# Altium schematic sheet Master.SchDoc
size A4; SheetNumber: 1; SheetTotal: 6
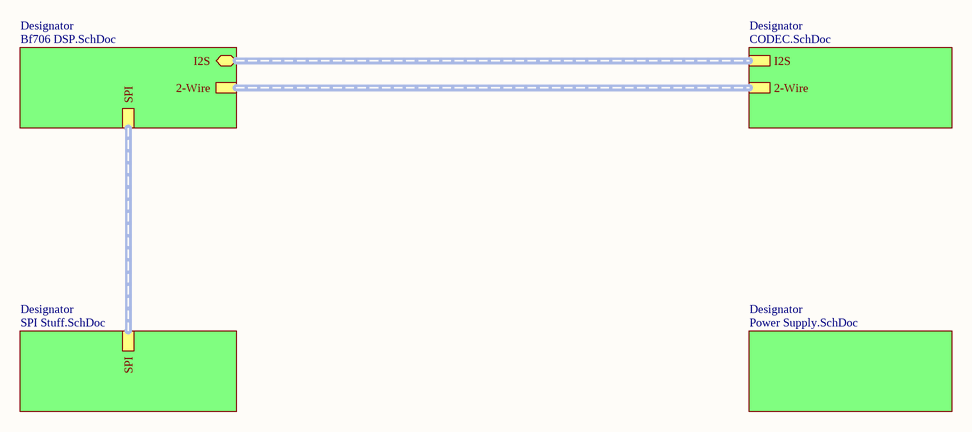
[diagram p0: Master.SchDoc]

## Sub-sheets
Designator = CODEC.SchDoc: I2S, 2-Wire
Designator = Power Supply.SchDoc: no entries
Designator = Bf706 DSP.SchDoc: I2S (bidir), 2-Wire, SPI
Designator = SPI Stuff.SchDoc: SPI